# Altium schematic sheet ValveToggling.SchDoc
size A
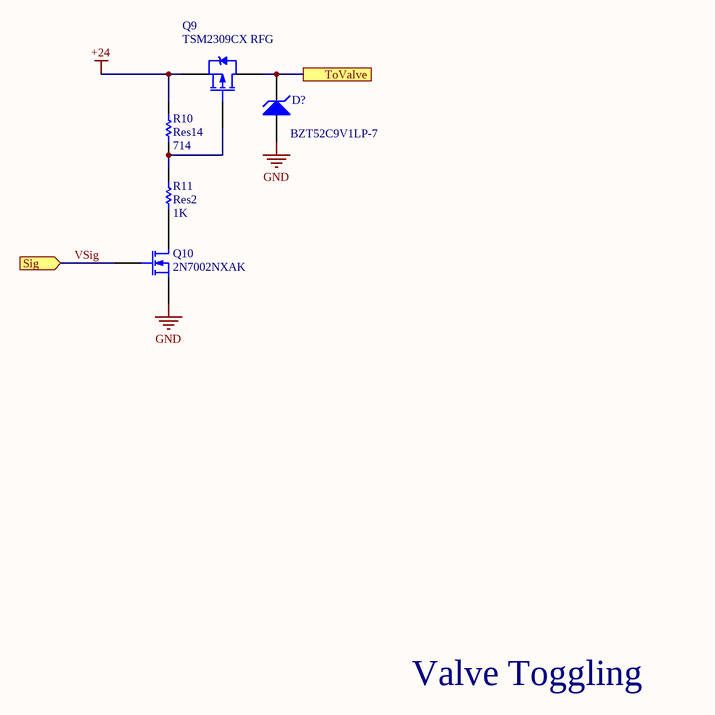
[diagram p0: ValveToggling.SchDoc]

## Parts
D?  BZT52C9V1LP-7  [0402]
Q9  TSM2309CX RFG  [SOT23_L]
Q10  2N7002NXAK  [SOT23_L]
R10  Res14  value 714  [0402]
R11  Res2  value 1K  [0402]

## Ports
Sig (in), ToValve

## Nets
+24: Q9.3(S) R10.2
GND: D?.1(A) Q10.3(S)
ToValve: D?.2(K) Q9.2(D) ; port ToValve
VSig: Q10.2(G) ; port Sig
NetQ9_1: Q9.1(G) R10.1 R11.2
NetQ10_1: Q10.1(D) R11.1

## Notes on the sheet
- Valve Toggling

## Library data of the parts
D? = D Zener: Zener Diode 9.1V 250mW ±6% Surface Mount X1-DFN1006-2; MFG: Diodes Incorporated; Package: 0402; MFG PN: BZT52C9V1LP-7
Q9 = PMOS-2: MOSFET P-CHANNEL 60V 3.1A SOT23; Note: Pin 4 not drawn and electrically connected to Pin 2.; Published: 8-Jun-2000; LatestRevisionDate: 17-Jul-2002; LatestRevisionNote: Re-released for DXP Platform.; DatasheetVersion: PD-9.390D; PackageVersion: Feb-1997; PackageReference: TO-220AB; Publisher: Altium Limited; PackageDescription: TO, Thru-Hole, Vertical, Heatsink Mounted; 3 In-Line Leads; Pitch 2.54 mm; ComponentLink1Description: Manufacturer Link; ComponentLink1URL: http://www.irf.com/
Q10 = MOSFET-N: N-Channel 60V 190mA (Ta), 300mA (Tc) 265mW (Ta), 1.33W (Tc) Surface Mount TO-236AB; MFG: Nexperia USA; MDF PN: 2N7002NXAK
R10 R11 = Res1: Resistor; Published: 8-Jun-2000; LatestRevisionDate: 17-Jul-2002; LatestRevisionNote: Re-released for DXP Platform.; PackageReference: AXIAL-0.3; Publisher: Altium Limited; PackageDescription: Axial Device, Thru-Hole; 2 Leads; 0.3 in Pin Spacing